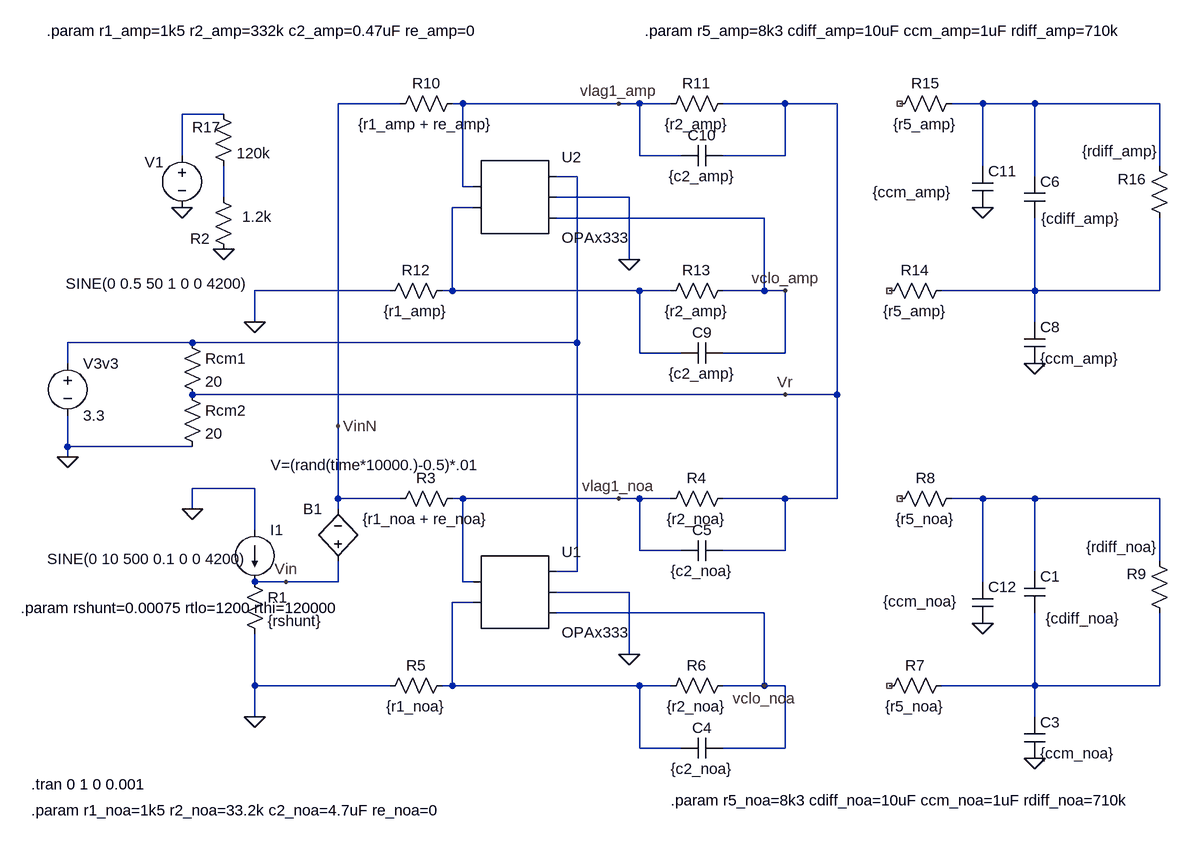
[diagram p0: schematic opa333_bipolar_dual.asc]
opa333_bipolar_dual.asc, the LTspice schematic file:
Version 4.1
SHEET 1 2568 680
WIRE 0 -592 -96 -592
WIRE 96 -592 80 -592
WIRE 336 -592 96 -592
WIRE 368 -592 336 -592
WIRE 416 -592 368 -592
WIRE 592 -592 496 -592
WIRE 672 -592 592 -592
WIRE 896 -592 848 -592
WIRE 976 -592 896 -592
WIRE 1168 -592 976 -592
WIRE -272 -576 -336 -576
WIRE -336 -512 -336 -576
WIRE 368 -512 368 -592
WIRE 432 -512 368 -512
WIRE 592 -512 592 -592
WIRE 592 -512 496 -512
WIRE 896 -496 896 -592
WIRE 1168 -496 1168 -592
WIRE 272 -480 240 -480
WIRE 976 -480 976 -592
WIRE 96 -464 96 -592
WIRE 112 -464 96 -464
WIRE -272 -448 -272 -496
WIRE 352 -448 240 -448
WIRE 112 -432 80 -432
WIRE 560 -416 240 -416
WIRE 352 -352 352 -448
WIRE -16 -304 -224 -304
WIRE 80 -304 80 -432
WIRE 80 -304 64 -304
WIRE 368 -304 80 -304
WIRE 416 -304 368 -304
WIRE 560 -304 560 -416
WIRE 560 -304 496 -304
WIRE 592 -304 560 -304
WIRE 976 -304 976 -416
WIRE 976 -304 832 -304
WIRE 1168 -304 1168 -416
WIRE 1168 -304 976 -304
WIRE -224 -256 -224 -304
WIRE 976 -256 976 -304
WIRE -320 -224 -512 -224
WIRE 272 -224 272 -480
WIRE 272 -224 -320 -224
WIRE 368 -208 368 -304
WIRE 432 -208 368 -208
WIRE 592 -208 592 -304
WIRE 592 -208 496 -208
WIRE -512 -192 -512 -224
WIRE 592 -144 -320 -144
WIRE 672 -144 672 -592
WIRE 672 -144 592 -144
WIRE -96 -96 -96 -592
WIRE -512 -64 -512 -112
WIRE -320 -64 -512 -64
WIRE -512 -48 -512 -64
WIRE -224 0 -320 0
WIRE -96 16 -96 -96
WIRE 0 16 -96 16
WIRE 96 16 80 16
WIRE 336 16 96 16
WIRE 368 16 336 16
WIRE 416 16 368 16
WIRE 592 16 496 16
WIRE 672 16 672 -144
WIRE 672 16 592 16
WIRE 896 16 848 16
WIRE 976 16 896 16
WIRE 1168 16 976 16
WIRE -320 32 -320 0
WIRE -96 32 -96 16
WIRE -224 64 -224 0
WIRE 368 96 368 16
WIRE 432 96 368 96
WIRE 592 96 592 16
WIRE 592 96 496 96
WIRE 1168 112 1168 16
WIRE 272 128 272 -224
WIRE 272 128 240 128
WIRE 976 128 976 16
WIRE -176 144 -224 144
WIRE -96 144 -96 112
WIRE -96 144 -176 144
WIRE 96 144 96 16
WIRE 112 144 96 144
WIRE 896 144 896 16
WIRE 352 160 240 160
WIRE 112 176 80 176
WIRE 560 192 240 192
WIRE 352 256 352 160
WIRE -224 304 -224 224
WIRE -16 304 -224 304
WIRE 80 304 80 176
WIRE 80 304 64 304
WIRE 368 304 80 304
WIRE 416 304 368 304
WIRE 560 304 560 192
WIRE 560 304 496 304
WIRE 592 304 560 304
WIRE 976 304 976 192
WIRE 976 304 832 304
WIRE 1168 304 1168 192
WIRE 1168 304 976 304
WIRE -224 352 -224 304
WIRE 976 352 976 304
WIRE 368 400 368 304
WIRE 432 400 368 400
WIRE 592 400 592 304
WIRE 592 400 496 400
FLAG 352 256 0
FLAG -320 32 0
FLAG -512 -48 0
FLAG -224 352 0
FLAG -176 144 Vin
FLAG 336 16 vlag1_noa
FLAG 352 -352 0
FLAG -224 -256 0
FLAG 336 -592 vlag1_amp
FLAG 976 416 0
FLAG 976 -192 0
FLAG 896 -432 0
FLAG 896 208 0
FLAG -272 -368 0
FLAG -336 -432 0
FLAG -96 -96 VinN
FLAG 592 -304 vclo_amp
FLAG 592 -144 Vr
FLAG 560 304 vclo_noa
SYMBOL Autogenerated\\OPAx333 176 160 R0
SYMATTR InstName U1
SYMBOL voltage -512 -208 R0
WINDOW 123 0 0 Left 0
WINDOW 39 0 0 Left 0
SYMATTR InstName V3v3
SYMATTR Value 3.3
SYMBOL res -336 -240 R0
SYMATTR InstName Rcm1
SYMATTR Value 20
SYMBOL res -336 -160 R0
SYMATTR InstName Rcm2
SYMATTR Value 20
SYMBOL res -240 128 R0
SYMATTR InstName R1
SYMATTR Value {rshunt}
SYMBOL res 96 0 R90
WINDOW 0 0 56 VBottom 2
WINDOW 3 32 56 VTop 2
SYMATTR InstName R3
SYMATTR Value {r1_noa + re_noa}
SYMBOL res 512 0 R90
WINDOW 0 0 56 VBottom 2
WINDOW 3 32 56 VTop 2
SYMATTR InstName R4
SYMATTR Value {r2_noa}
SYMBOL res 80 288 R90
WINDOW 0 0 56 VBottom 2
WINDOW 3 32 56 VTop 2
SYMATTR InstName R5
SYMATTR Value {r1_noa}
SYMBOL res 512 288 R90
WINDOW 0 0 56 VBottom 2
WINDOW 3 32 56 VTop 2
SYMATTR InstName R6
SYMATTR Value {r2_noa}
SYMBOL res 848 288 R90
WINDOW 0 0 56 VBottom 2
WINDOW 3 32 56 VTop 2
SYMATTR InstName R7
SYMATTR Value {r5_noa}
SYMBOL res 864 0 R90
WINDOW 0 0 56 VBottom 2
WINDOW 3 32 56 VTop 2
SYMATTR InstName R8
SYMATTR Value {r5_noa}
SYMBOL res 1184 208 R180
WINDOW 0 36 76 Left 2
WINDOW 3 18 118 Left 2
SYMATTR InstName R9
SYMATTR Value {rdiff_noa}
SYMBOL cap 960 128 R0
WINDOW 3 33 72 Left 2
SYMATTR Value {cdiff_noa}
SYMATTR InstName C1
SYMBOL cap 960 352 R0
SYMATTR InstName C3
SYMATTR Value {ccm_noa}
SYMBOL current -224 64 R0
WINDOW 3 -319 45 Left 2
WINDOW 123 0 0 Left 0
WINDOW 39 0 0 Left 0
SYMATTR Value SINE(0 10 500 0.1 0 0 4200)
SYMATTR InstName I1
SYMBOL cap 496 384 R90
WINDOW 0 0 32 VBottom 2
WINDOW 3 32 32 VTop 2
SYMATTR InstName C4
SYMATTR Value {c2_noa}
SYMBOL cap 496 80 R90
WINDOW 0 0 32 VBottom 2
WINDOW 3 32 32 VTop 2
SYMATTR InstName C5
SYMATTR Value {c2_noa}
SYMBOL Autogenerated\\OPAx333 176 -448 R0
SYMATTR InstName U2
SYMBOL res 96 -608 R90
WINDOW 0 0 56 VBottom 2
WINDOW 3 32 56 VTop 2
SYMATTR InstName R10
SYMATTR Value {r1_amp + re_amp}
SYMBOL res 512 -608 R90
WINDOW 0 0 56 VBottom 2
WINDOW 3 32 56 VTop 2
SYMATTR InstName R11
SYMATTR Value {r2_amp}
SYMBOL res 80 -320 R90
WINDOW 0 0 56 VBottom 2
WINDOW 3 32 56 VTop 2
SYMATTR InstName R12
SYMATTR Value {r1_amp}
SYMBOL res 512 -320 R90
WINDOW 0 0 56 VBottom 2
WINDOW 3 32 56 VTop 2
SYMATTR InstName R13
SYMATTR Value {r2_amp}
SYMBOL res 848 -320 R90
WINDOW 0 0 56 VBottom 2
WINDOW 3 32 56 VTop 2
SYMATTR InstName R14
SYMATTR Value {r5_amp}
SYMBOL res 864 -608 R90
WINDOW 0 0 56 VBottom 2
WINDOW 3 32 56 VTop 2
SYMATTR InstName R15
SYMATTR Value {r5_amp}
SYMBOL res 1184 -400 R180
WINDOW 0 36 76 Left 2
WINDOW 3 17 119 Left 2
SYMATTR InstName R16
SYMATTR Value {rdiff_amp}
SYMBOL cap 960 -480 R0
WINDOW 3 26 65 Left 2
SYMATTR Value {cdiff_amp}
SYMATTR InstName C6
SYMBOL cap 960 -256 R0
SYMATTR InstName C8
SYMATTR Value {ccm_amp}
SYMBOL cap 496 -224 R90
WINDOW 0 0 32 VBottom 2
WINDOW 3 32 32 VTop 2
SYMATTR InstName C9
SYMATTR Value {c2_amp}
SYMBOL cap 496 -528 R90
WINDOW 0 0 32 VBottom 2
WINDOW 3 32 32 VTop 2
SYMATTR InstName C10
SYMATTR Value {c2_amp}
SYMBOL cap 880 -496 R0
WINDOW 3 -153 40 Left 2
SYMATTR Value {ccm_amp}
SYMATTR InstName C11
SYMBOL cap 880 144 R0
WINDOW 3 -137 30 Left 2
SYMATTR Value {ccm_noa}
SYMATTR InstName C12
SYMBOL voltage -336 -528 R0
WINDOW 3 -179 213 Left 2
WINDOW 123 0 0 Left 0
WINDOW 39 0 0 Left 0
WINDOW 0 -57 26 Left 2
SYMATTR Value SINE(0 0.5 50 1 0 0 4200)
SYMATTR InstName V1
SYMBOL res -288 -464 R0
WINDOW 3 45 46 Left 2
WINDOW 0 -35 80 Left 2
SYMATTR Value 1.2k
SYMATTR InstName R2
SYMBOL bv -96 128 R180
WINDOW 0 24 96 Left 2
WINDOW 3 -222 164 Left 2
SYMATTR InstName B1
SYMATTR Value V=(rand(time*10000.)-0.5)*.01
SYMBOL res -288 -592 R0
WINDOW 0 -32 36 Left 2
SYMATTR InstName R17
SYMATTR Value 120k
TEXT -568 456 Left 2 !.tran 0 1 0 0.001
TEXT -584 184 Left 2 !.param rshunt=0.00075 rtlo=1200 rthi=120000
TEXT -568 496 Left 2 !.param r1_noa=1k5 r2_noa=33.2k c2_noa=4.7uF re_noa=0
TEXT -544 -704 Left 2 !.param r1_amp=1k5 r2_amp=332k c2_amp=0.47uF re_amp=0
TEXT 416 480 Left 2 !.param r5_noa=8k3 cdiff_noa=10uF ccm_noa=1uF rdiff_noa=710k
TEXT 376 -704 Left 2 !.param r5_amp=8k3 cdiff_amp=10uF ccm_amp=1uF rdiff_amp=710k

The netlist it stands for:
* opa333_bipolar_dual.asc
* U1: OPAx333 (symbol Autogenerated\OPAx333 not available, pins judged from their places): pin1=vlag1_noa pin2=N008 pin3=N003 pin4=0 pin5=vclo_noa
V3v3 N003 0 3.3
Rcm1 N003 Vr 20
Rcm2 Vr 0 20
R1 Vin 0 {rshunt}
R3 vlag1_noa VinN {r1_noa + re_noa}
R4 Vr vlag1_noa {r2_noa}
R5 N008 0 {r1_noa}
R6 vclo_noa N008 {r2_noa}
R7 N009 NC_01 {r5_noa}
R8 N007 NC_02 {r5_noa}
R9 N009 N007 {rdiff_noa}
C1 N007 N009 {cdiff_noa}
C3 N009 0 {ccm_noa}
I1 0 Vin SINE(0 10 500 0.1 0 0 4200)
C4 vclo_noa N008 {c2_noa}
C5 Vr vlag1_noa {c2_noa}
* U2: OPAx333 (symbol Autogenerated\OPAx333 not available, pins judged from their places): pin1=vlag1_amp pin2=N005 pin3=N003 pin4=0 pin5=vclo_amp
R10 vlag1_amp VinN {r1_amp + re_amp}
R11 Vr vlag1_amp {r2_amp}
R12 N005 0 {r1_amp}
R13 vclo_amp N005 {r2_amp}
R14 N006 NC_03 {r5_amp}
R15 N001 NC_04 {r5_amp}
R16 N006 N001 {rdiff_amp}
C6 N001 N006 {cdiff_amp}
C8 N006 0 {ccm_amp}
C9 vclo_amp N005 {c2_amp}
C10 Vr vlag1_amp {c2_amp}
C11 N001 0 {ccm_amp}
C12 N007 0 {ccm_noa}
V1 N002 0 SINE(0 0.5 50 1 0 0 4200)
R2 N004 0 1.2k
B1 Vin VinN V=(rand(time*10000.)-0.5)*.01
R17 N002 N004 120k
.tran 0 1 0 0.001
.param rshunt=0.00075 rtlo=1200 rthi=120000
.param r1_noa=1k5 r2_noa=33.2k c2_noa=4.7uF re_noa=0
.param r1_amp=1k5 r2_amp=332k c2_amp=0.47uF re_amp=0
.param r5_noa=8k3 cdiff_noa=10uF ccm_noa=1uF rdiff_noa=710k
.param r5_amp=8k3 cdiff_amp=10uF ccm_amp=1uF rdiff_amp=710k
.backanno
.end